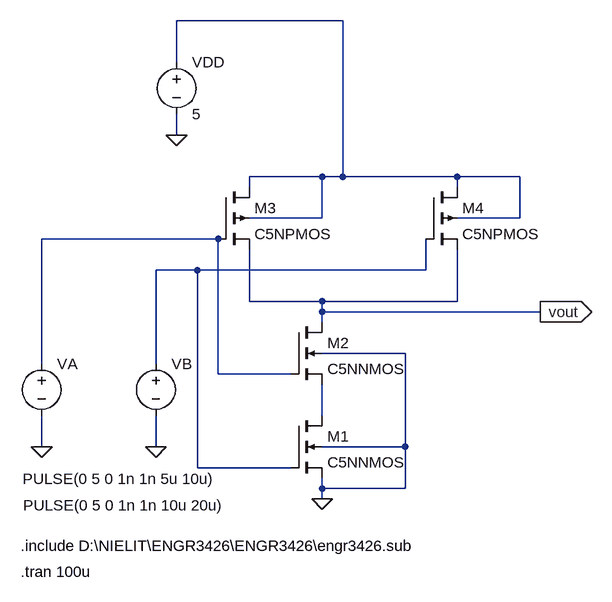
[diagram p0: schematic NAND.asc]
NAND.asc, the LTspice schematic file:
Version 4
SHEET 1 1100 680
WIRE 272 -304 16 -304
WIRE 16 -240 16 -304
WIRE 16 -128 16 -160
WIRE 240 -64 128 -64
WIRE 272 -64 272 -304
WIRE 272 -64 240 -64
WIRE 448 -64 272 -64
WIRE 544 -64 448 -64
WIRE 128 -48 128 -64
WIRE 448 -48 448 -64
WIRE 240 0 240 -64
WIRE 240 0 128 0
WIRE 544 0 544 -64
WIRE 544 0 448 0
WIRE 80 32 -192 32
WIRE 48 80 -16 80
WIRE 400 80 400 32
WIRE 400 80 48 80
WIRE 128 128 128 48
WIRE 240 128 128 128
WIRE 448 128 448 48
WIRE 448 128 240 128
WIRE 240 144 240 128
WIRE 576 144 240 144
WIRE 240 160 240 144
WIRE 368 208 240 208
WIRE -192 224 -192 32
WIRE -16 224 -16 80
WIRE 80 240 80 32
WIRE 192 240 80 240
WIRE 240 304 240 256
WIRE -192 352 -192 304
WIRE -16 352 -16 304
WIRE 368 352 368 208
WIRE 368 352 240 352
WIRE 48 384 48 80
WIRE 192 384 48 384
WIRE 240 416 240 400
WIRE 368 416 368 352
WIRE 368 416 240 416
WIRE 240 432 240 416
FLAG 240 432 0
FLAG -192 352 0
FLAG -16 352 0
FLAG 16 -128 0
FLAG 576 144 vout
IOPIN 576 144 Out
SYMBOL nmos4 192 304 R0
SYMATTR InstName M1
SYMATTR Value C5NNMOS
SYMATTR Value2 l=0.6u w=3.6u
SYMBOL nmos4 192 160 R0
SYMATTR InstName M2
SYMATTR Value C5NNMOS
SYMATTR Value2 l=0.6u w=3.6u
SYMBOL pmos4 80 -48 R0
SYMATTR InstName M3
SYMATTR Value C5NPMOS
SYMATTR Value2 l=0.6u w=7.2u
SYMBOL pmos4 400 -48 R0
SYMATTR InstName M4
SYMATTR Value C5NPMOS
SYMATTR Value2 l=0.6u w=7.2u
SYMBOL voltage -192 208 R0
WINDOW 3 -29 193 Left 2
WINDOW 123 0 0 Left 0
WINDOW 39 0 0 Left 0
SYMATTR Value PULSE(0 5 0 1n 1n 5u 10u)
SYMATTR InstName VA
SYMBOL voltage -16 208 R0
WINDOW 3 -204 234 Left 2
WINDOW 123 0 0 Left 0
WINDOW 39 0 0 Left 0
SYMATTR Value PULSE(0 5 0 1n 1n 10u 20u)
SYMATTR InstName VB
SYMBOL voltage 16 -256 R0
WINDOW 123 0 0 Left 0
WINDOW 39 0 0 Left 0
SYMATTR InstName VDD
SYMATTR Value 5
TEXT -224 544 Left 2 !.tran 100u
TEXT -224 504 Left 2 !.include D:\\NIELIT\\ENGR3426\\ENGR3426\\engr3426.sub

The netlist it stands for:
* NAND.asc
M1 N004 N003 0 0 C5NNMOS l=0.6u w=3.6u
M2 vout N002 N004 0 C5NNMOS l=0.6u w=3.6u
M3 N001 N002 vout N001 C5NPMOS l=0.6u w=7.2u
M4 N001 N003 vout N001 C5NPMOS l=0.6u w=7.2u
VA N002 0 PULSE(0 5 0 1n 1n 5u 10u)
VB N003 0 PULSE(0 5 0 1n 1n 10u 20u)
VDD N001 0 5
.model NMOS NMOS
.model PMOS PMOS
.lib standard.mos
.tran 100u
.include D:\NIELIT\ENGR3426\ENGR3426\engr3426.sub
.backanno
.end